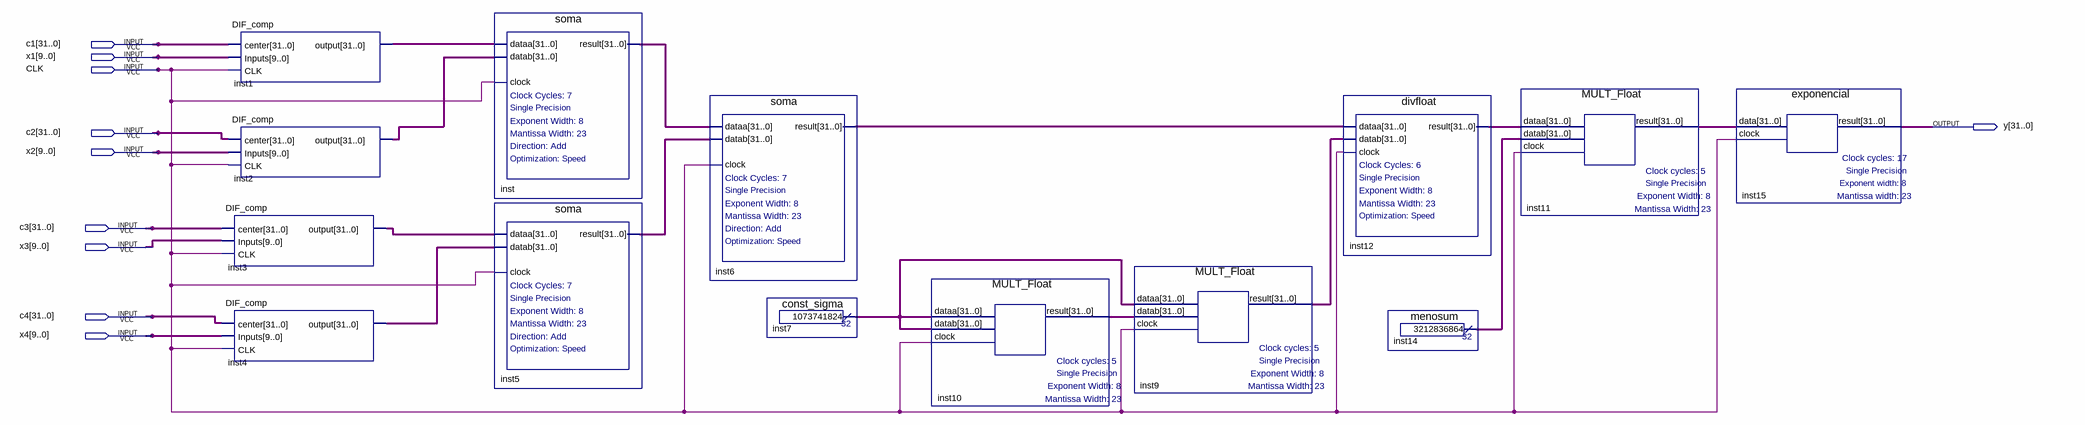
[diagram p0: schematic sheet]
// Quartus schematic kernelRBF.bdf as structural Verilog: 14 symbols, 10 pins
module kernelRBF (
  input  [31:0] c1,
  input  [9:0] x1,
  input  CLK,
  input  [31:0] c2,
  input  [9:0] x2,
  input  [31:0] c3,
  input  [9:0] x3,
  input  [31:0] c4,
  input  [9:0] x4,
  output [31:0] y
);

  wire [31:0] inst1_output, inst2_output, inst3_output, inst4_output, inst5_result, inst6_result,
       inst7_result, inst9_result, inst10_result, inst11_result, inst12_result, inst14_result, inst_result;

  DIF_comp inst1 (.center(c1), .Inputs(x1), .CLK(CLK), .\output (inst1_output));
  DIF_comp inst2 (.center(c2), .Inputs(x2), .CLK(CLK), .\output (inst2_output));
  DIF_comp inst3 (.center(c3), .Inputs(x3), .CLK(CLK), .\output (inst3_output));
  DIF_comp inst4 (.center(c4), .Inputs(x4), .CLK(CLK), .\output (inst4_output));
  soma inst (.dataa(inst1_output), .datab(inst2_output), .clock(CLK), .result(inst_result));
  soma inst5 (.dataa(inst3_output), .datab(inst4_output), .clock(CLK), .result(inst5_result));
  soma inst6 (.dataa(inst_result), .datab(inst5_result), .clock(CLK), .result(inst6_result));
  const_sigma inst7 (.result(inst7_result));
  MULT_Float inst10 (.dataa(inst7_result), .datab(inst7_result), .clock(CLK), .result(inst10_result));
  MULT_Float inst9 (.dataa(inst7_result), .datab(inst10_result), .clock(CLK), .result(inst9_result));
  divfloat inst12 (.dataa(inst6_result), .datab(inst9_result), .clock(CLK), .result(inst12_result));
  menosum inst14 (.result(inst14_result));
  MULT_Float inst11 (.dataa(inst12_result), .datab(inst14_result), .clock(CLK), .result(inst11_result));
  exponencial inst15 (.data(inst11_result), .clock(CLK), .result(y));
endmodule
